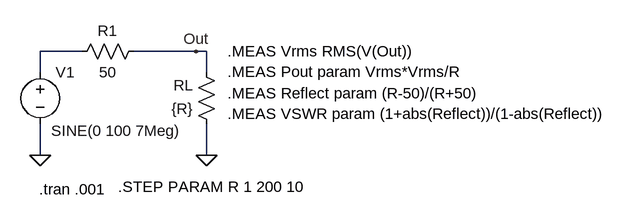
[diagram p0: schematic final.asc]
final.asc, the LTspice schematic file:
Version 4
SHEET 1 1056 680
WIRE 144 112 80 112
WIRE 320 112 224 112
WIRE 336 112 320 112
WIRE 80 144 80 112
WIRE 336 144 336 112
WIRE 80 272 80 224
WIRE 336 272 336 224
FLAG 80 272 0
FLAG 336 272 0
FLAG 320 112 Out
SYMBOL voltage 80 128 R0
WINDOW 3 17 106 Left 2
WINDOW 123 0 0 Left 2
WINDOW 39 0 0 Left 2
SYMATTR InstName V1
SYMATTR Value SINE(0 100 7Meg)
SYMBOL res 240 96 R90
WINDOW 0 0 56 VBottom 2
WINDOW 3 32 56 VTop 2
SYMATTR InstName R1
SYMATTR Value 50
SYMBOL res 352 240 R180
WINDOW 0 36 76 Left 2
WINDOW 3 36 40 Left 2
SYMATTR InstName RL
SYMATTR Value {R}
TEXT 200 320 Left 2 !.STEP PARAM R 1 200 10
TEXT 78 324 Left 2 !.tran .001
TEXT 368 112 Left 2 !.MEAS Vrms RMS(V(Out))\n.MEAS Pout param Vrms*Vrms/R
TEXT 368 176 Left 2 !.MEAS Reflect param (R-50)/(R+50)
TEXT 368 208 Left 2 !.MEAS VSWR param (1+abs(Reflect))/(1-abs(Reflect))

The netlist it stands for:
* final.asc
V1 N001 0 SINE(0 100 7Meg)
R1 Out N001 50
RL 0 Out {R}
.STEP PARAM R 1 200 10
.tran .001
.MEAS Vrms RMS(V(Out))
.MEAS Pout param Vrms*Vrms/R
.MEAS Reflect param (R-50)/(R+50)
.MEAS VSWR param (1+abs(Reflect))/(1-abs(Reflect))
.backanno
.end